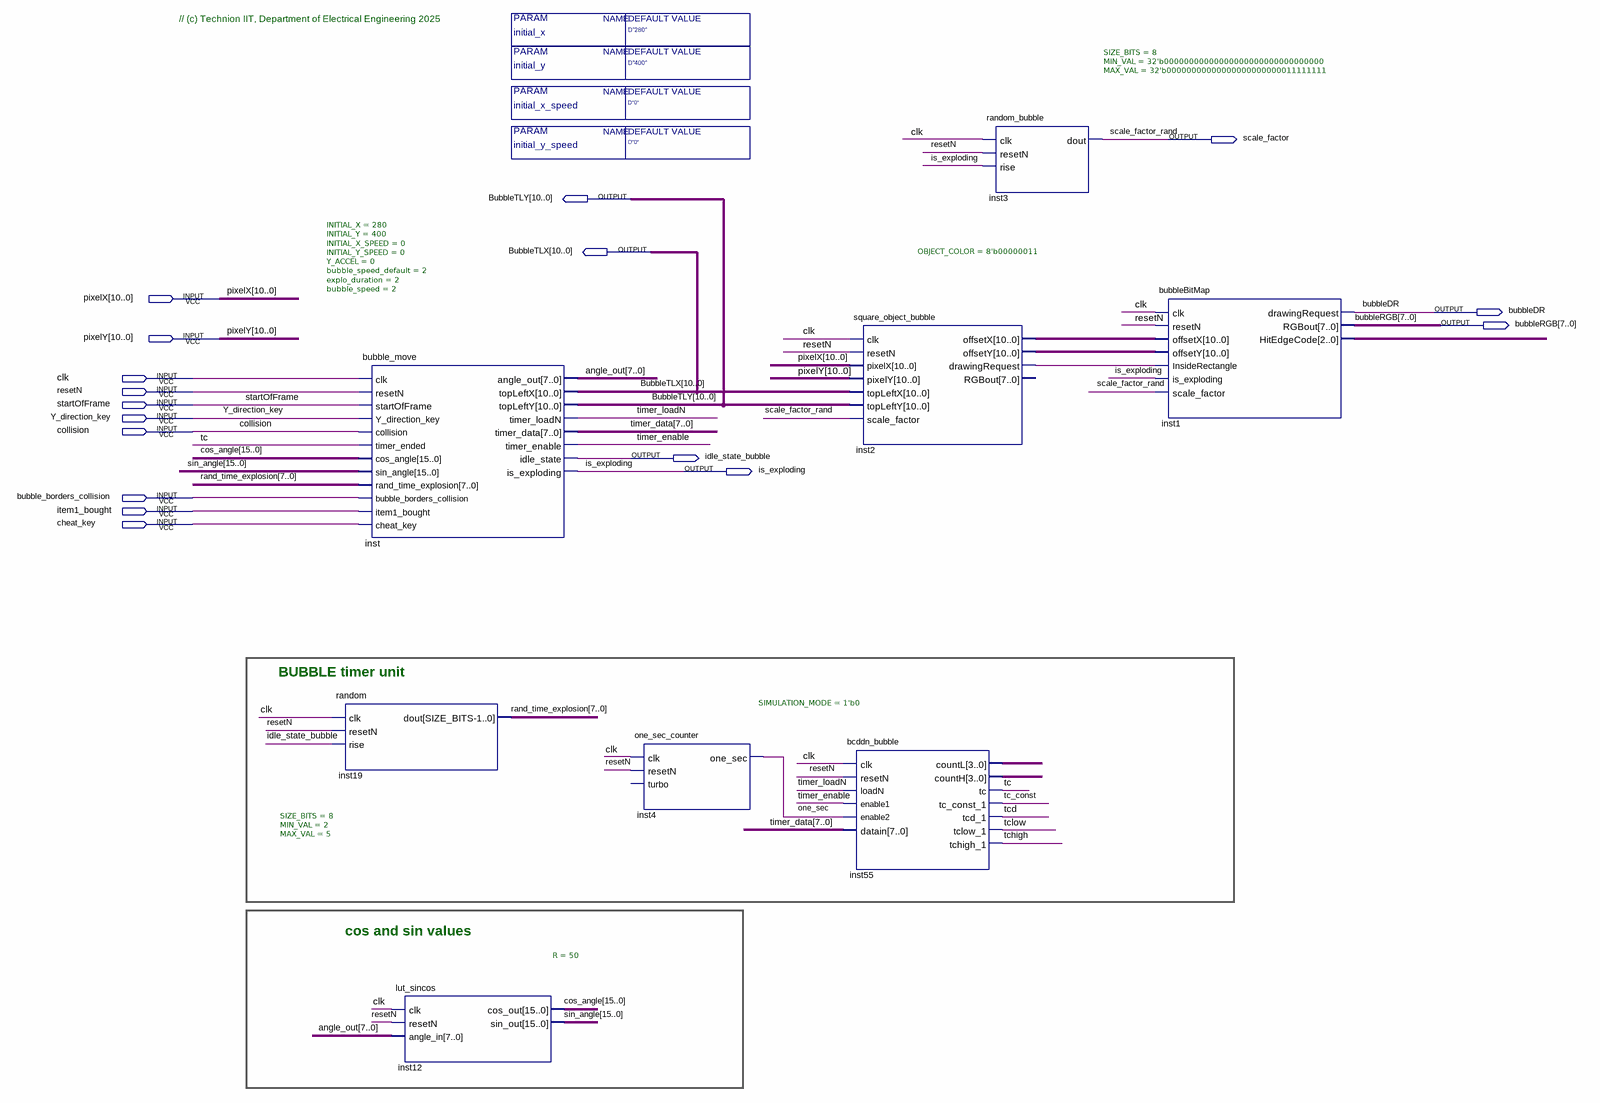
[diagram p0: schematic sheet]
// Quartus schematic Bubble_Block_T.bdf as structural Verilog: 8 symbols, 17 pins
module Bubble_Block_T #(parameter initial_x = "D\"280\"", parameter initial_y = "D\"400\"", parameter initial_x_speed = "D\"0\"", parameter initial_y_speed = "D\"0\"") (
  input  [10:0] pixelX,
  input  [10:0] pixelY,
  input  clk,
  input  resetN,
  input  startOfFrame,
  input  Y_direction_key,
  input  collision,
  input  bubble_borders_collision,
  input  item1_bought,
  input  cheat_key,
  output scale_factor,
  output [10:0] BubbleTLY,
  output [10:0] BubbleTLX,
  output bubbleDR,
  output [7:0] bubbleRGB,
  output idle_state_bubble,
  output is_exploding
);

  wire inst2_drawingrequest, one_sec, tc, tc_const, tcd, tchigh, tclow, timer_enable, timer_loadN;
  wire [2:0] inst1_hitedgecode;
  wire [3:0] inst55_counth, inst55_countl;
  wire [7:0] angle_out, rand_time_explosion, timer_data;
  wire [10:0] inst2_offsetx, inst2_offsety;
  wire [15:0] cos_angle, sin_angle;

  random #(.SIZE_BITS(8), .MIN_VAL(2), .MAX_VAL(5)) inst19 (
    .clk(clk), .resetN(resetN), .rise(idle_state_bubble), .dout(rand_time_explosion));
  bubble_move #(.INITIAL_X(280), .INITIAL_Y(400), .INITIAL_X_SPEED(0), .INITIAL_Y_SPEED(0), .Y_ACCEL(0), .bubble_speed_default(2), .explo_duration(2), .bubble_speed(2)) inst (
    .clk(clk), .resetN(resetN), .startOfFrame(startOfFrame), .Y_direction_key(Y_direction_key),
    .collision(collision), .timer_ended(tc), .cos_angle(cos_angle), .sin_angle(sin_angle),
    .rand_time_explosion(rand_time_explosion), .bubble_borders_collision(bubble_borders_collision),
    .item1_bought(item1_bought), .cheat_key(cheat_key), .angle_out(angle_out), .topLeftX(BubbleTLX),
    .topLeftY(BubbleTLY), .timer_loadN(timer_loadN), .timer_data(timer_data), .timer_enable(timer_enable),
    .idle_state(idle_state_bubble), .is_exploding(is_exploding));
  lut_sincos #(.R(50)) inst12 (
    .clk(clk), .resetN(resetN), .angle_in(angle_out), .cos_out(cos_angle), .sin_out(sin_angle));
  one_sec_counter #(.SIMULATION_MODE(1'b0)) inst4 (.clk(clk), .resetN(resetN), .one_sec(one_sec));  // open: turbo
  square_object_bubble #(.OBJECT_COLOR(8'b00000011)) inst2 (
    .clk(clk), .resetN(resetN), .pixelX(pixelX), .pixelY(pixelY), .topLeftX(BubbleTLX), .topLeftY(BubbleTLY),
    .scale_factor(scale_factor), .offsetX(inst2_offsetx), .offsetY(inst2_offsety),
    .drawingRequest(inst2_drawingrequest));  // open: RGBout
  bcddn_bubble inst55 (
    .clk(clk), .resetN(resetN), .loadN(timer_loadN), .enable1(timer_enable), .enable2(one_sec),
    .datain(timer_data), .countL(inst55_countl), .countH(inst55_counth), .tc(tc), .tc_const_1(tc_const),
    .tcd_1(tcd), .tclow_1(tclow), .tchigh_1(tchigh));
  random_bubble #(.SIZE_BITS(8), .MIN_VAL(32'b00000000000000000000000000000000), .MAX_VAL(32'b00000000000000000000000011111111)) inst3 (
    .clk(clk), .resetN(resetN), .rise(is_exploding), .dout(scale_factor));
  bubbleBitMap inst1 (
    .clk(clk), .resetN(resetN), .offsetX(inst2_offsetx), .offsetY(inst2_offsety),
    .InsideRectangle(inst2_drawingrequest), .is_exploding(is_exploding), .scale_factor(scale_factor),
    .drawingRequest(bubbleDR), .RGBout(bubbleRGB), .HitEdgeCode(inst1_hitedgecode));

  // Other names for the same wires on the sheet: scale_factor_rand = scale_factor

  // Notes on the sheet:
  //   // (c) Technion IIT, Department of Electrical Engineering 2025
  //   BUBBLE timer unit
  //   cos and sin values
endmodule
